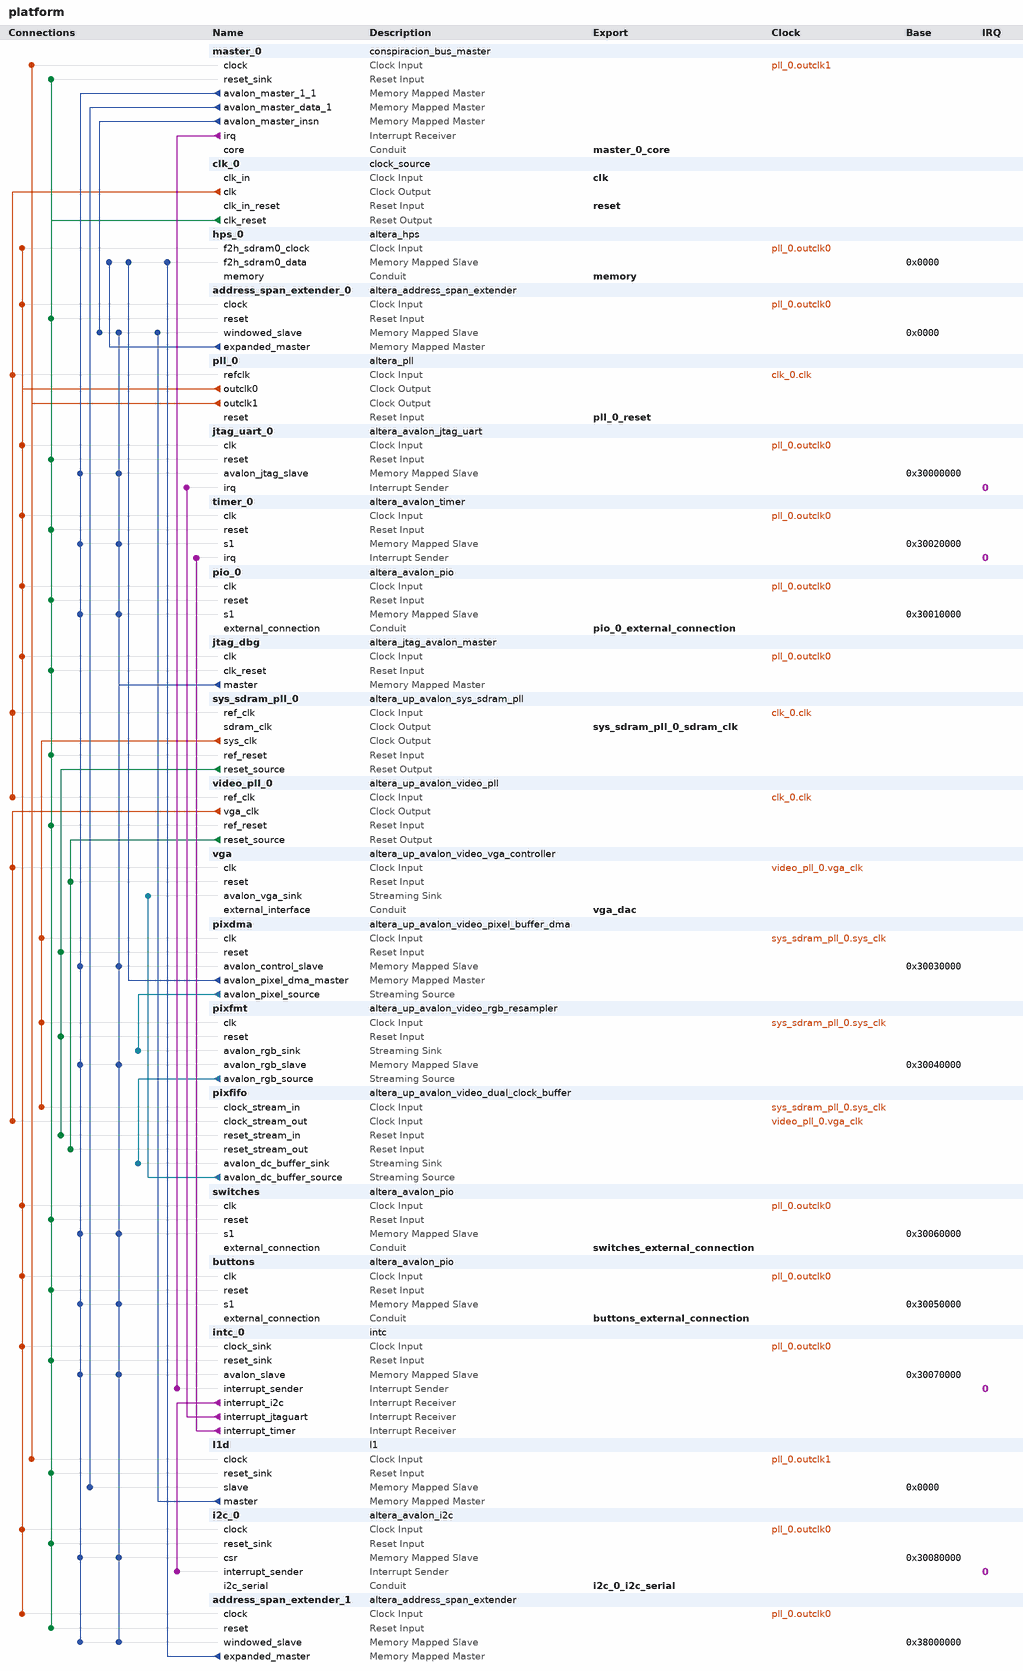
[diagram p0: system contents]
# Platform Designer (Qsys) system platform, Cyclone V 5CSEBA6U23I7
# Parameters at their usual value, and those the tool derives, are not listed.
package require -exact qsys 20.1
create_system platform
set_project_property DEVICE_FAMILY {Cyclone V}
set_project_property DEVICE 5CSEBA6U23I7

add_instance master_0 conspiracion_bus_master 1.0

add_instance clk_0 clock_source 20.1
set_instance_parameter_value clk_0 clockFrequency 50000000

add_instance hps_0 altera_hps 20.1
set_instance_parameter_value hps_0 EMAC1_Mode N/A
set_instance_parameter_value hps_0 EMAC1_PinMuxing Unused
set_instance_parameter_value hps_0 F2SCLK_COLDRST_Enable false
set_instance_parameter_value hps_0 F2SCLK_DBGRST_Enable false
set_instance_parameter_value hps_0 F2SCLK_WARMRST_Enable false
set_instance_parameter_value hps_0 F2SDRAM_Type {Avalon-MM Bidirectional}
set_instance_parameter_value hps_0 F2SDRAM_Width 128
set_instance_parameter_value hps_0 F2SINTERRUPT_Enable false
set_instance_parameter_value hps_0 F2S_Width 0
set_instance_parameter_value hps_0 FPGA_PERIPHERAL_OUTPUT_CLOCK_FREQ_EMAC0_GTX_CLK 125
set_instance_parameter_value hps_0 FPGA_PERIPHERAL_OUTPUT_CLOCK_FREQ_EMAC0_MD_CLK 2.5
set_instance_parameter_value hps_0 FPGA_PERIPHERAL_OUTPUT_CLOCK_FREQ_EMAC1_GTX_CLK 125
set_instance_parameter_value hps_0 FPGA_PERIPHERAL_OUTPUT_CLOCK_FREQ_EMAC1_MD_CLK 2.5
set_instance_parameter_value hps_0 HPS_PROTOCOL DDR3
set_instance_parameter_value hps_0 I2C0_Mode N/A
set_instance_parameter_value hps_0 I2C0_PinMuxing Unused
set_instance_parameter_value hps_0 I2C1_Mode N/A
set_instance_parameter_value hps_0 I2C1_PinMuxing Unused
set_instance_parameter_value hps_0 LWH2F_Enable false
set_instance_parameter_value hps_0 MEM_BANKADDR_WIDTH 3
set_instance_parameter_value hps_0 MEM_CLK_FREQ 300.0
set_instance_parameter_value hps_0 MEM_CLK_FREQ_MAX 400.0
set_instance_parameter_value hps_0 MEM_COL_ADDR_WIDTH 8
set_instance_parameter_value hps_0 MEM_DQ_WIDTH 8
set_instance_parameter_value hps_0 MEM_DRV_STR RZQ/6
set_instance_parameter_value hps_0 MEM_ROW_ADDR_WIDTH 12
set_instance_parameter_value hps_0 MEM_RTT_NOM {ODT Disabled}
set_instance_parameter_value hps_0 MEM_RTT_WR {Dynamic ODT off}
set_instance_parameter_value hps_0 MEM_TCL 7
set_instance_parameter_value hps_0 MEM_TFAW_NS 37.5
set_instance_parameter_value hps_0 MEM_TINIT_US 499
set_instance_parameter_value hps_0 MEM_TMRD_CK 3
set_instance_parameter_value hps_0 MEM_TRAS_NS 40.0
set_instance_parameter_value hps_0 MEM_TRCD_NS 15.0
set_instance_parameter_value hps_0 MEM_TREFI_US 7.0
set_instance_parameter_value hps_0 MEM_TRFC_NS 75.0
set_instance_parameter_value hps_0 MEM_TRP_NS 15.0
set_instance_parameter_value hps_0 MEM_TWTR 2
set_instance_parameter_value hps_0 MEM_VENDOR JEDEC
set_instance_parameter_value hps_0 MEM_WTCL 6
set_instance_parameter_value hps_0 QSPI_Mode N/A
set_instance_parameter_value hps_0 QSPI_PinMuxing Unused
set_instance_parameter_value hps_0 REF_CLK_FREQ 125.0
set_instance_parameter_value hps_0 S2FCLK_USER2CLK 5
set_instance_parameter_value hps_0 S2F_Width 0
set_instance_parameter_value hps_0 SDIO_Mode N/A
set_instance_parameter_value hps_0 SDIO_PinMuxing Unused
set_instance_parameter_value hps_0 SPIM1_Mode N/A
set_instance_parameter_value hps_0 SPIM1_PinMuxing Unused
set_instance_parameter_value hps_0 STM_Enable false
set_instance_parameter_value hps_0 TIMING_BOARD_AC_SKEW 0.02
set_instance_parameter_value hps_0 TIMING_BOARD_AC_TO_CK_SKEW 0.0
set_instance_parameter_value hps_0 TIMING_BOARD_DQ_TO_DQS_SKEW 0.0
set_instance_parameter_value hps_0 TIMING_BOARD_MAX_CK_DELAY 0.6
set_instance_parameter_value hps_0 TIMING_BOARD_MAX_DQS_DELAY 0.6
set_instance_parameter_value hps_0 TIMING_BOARD_SKEW_BETWEEN_DQS 0.02
set_instance_parameter_value hps_0 TIMING_BOARD_SKEW_CKDQS_DIMM_MAX 0.01
set_instance_parameter_value hps_0 TIMING_BOARD_SKEW_CKDQS_DIMM_MIN -0.01
set_instance_parameter_value hps_0 TIMING_BOARD_SKEW_WITHIN_DQS 0.02
set_instance_parameter_value hps_0 TIMING_TDH 125
set_instance_parameter_value hps_0 TIMING_TDQSCK 400
set_instance_parameter_value hps_0 TIMING_TDQSQ 120
set_instance_parameter_value hps_0 TIMING_TDS 50
set_instance_parameter_value hps_0 TIMING_TIH 250
set_instance_parameter_value hps_0 TIMING_TIS 175
set_instance_parameter_value hps_0 TIMING_TQSH 0.38
set_instance_parameter_value hps_0 UART0_Mode N/A
set_instance_parameter_value hps_0 UART0_PinMuxing Unused
set_instance_parameter_value hps_0 USB1_Mode N/A
set_instance_parameter_value hps_0 USB1_PinMuxing Unused
set_instance_parameter_value hps_0 desired_cfg_clk_mhz 100.0
set_instance_parameter_value hps_0 desired_qspi_clk_mhz 400.0

add_instance address_span_extender_0 altera_address_span_extender 20.1
set_instance_parameter_value address_span_extender_0 BURSTCOUNT_WIDTH 1
set_instance_parameter_value address_span_extender_0 DATA_WIDTH 128
set_instance_parameter_value address_span_extender_0 ENABLE_SLAVE_PORT false
set_instance_parameter_value address_span_extender_0 MASTER_ADDRESS_DEF 536870912
set_instance_parameter_value address_span_extender_0 MAX_PENDING_READS 1
set_instance_parameter_value address_span_extender_0 SLAVE_ADDRESS_WIDTH 25

add_instance pll_0 altera_pll 20.1
set_instance_parameter_value pll_0 gui_device_speed_grade 1
set_instance_parameter_value pll_0 gui_number_of_clocks 2
set_instance_parameter_value pll_0 gui_operation_mode direct
set_instance_parameter_value pll_0 gui_output_clock_frequency0 50.0
set_instance_parameter_value pll_0 gui_output_clock_frequency1 80.0
set_instance_parameter_value pll_0 gui_pll_auto_reset On
set_instance_parameter_value pll_0 gui_pll_mode {Fractional-N PLL}
set_instance_parameter_value pll_0 gui_reference_clock_frequency 50.0
set_instance_parameter_value pll_0 gui_use_locked false

add_instance jtag_uart_0 altera_avalon_jtag_uart 20.1
set_instance_parameter_value jtag_uart_0 simInteractiveOptions NO_INTERACTIVE_WINDOWS

add_instance timer_0 altera_avalon_timer 20.1
set_instance_parameter_value timer_0 period 1
set_instance_parameter_value timer_0 periodUnits MSEC

add_instance pio_0 altera_avalon_pio 20.1
set_instance_parameter_value pio_0 bitModifyingOutReg true
set_instance_parameter_value pio_0 direction Output
set_instance_parameter_value pio_0 width 8

add_instance jtag_dbg altera_jtag_avalon_master 20.1

add_instance sys_sdram_pll_0 altera_up_avalon_sys_sdram_pll 18.0
set_instance_parameter_value sys_sdram_pll_0 CV_boards DE1-SoC
set_instance_parameter_value sys_sdram_pll_0 gui_outclk 143.0
set_instance_parameter_value sys_sdram_pll_0 gui_refclk 50.0

add_instance video_pll_0 altera_up_avalon_video_pll 18.0
set_instance_parameter_value video_pll_0 camera {5MP Digital Camera (THDB_D5M)}
set_instance_parameter_value video_pll_0 gui_refclk 50.0
set_instance_parameter_value video_pll_0 lcd {7" LCD on VEEK-MT and MTL/MTL2 Modules}

add_instance vga altera_up_avalon_video_vga_controller 18.0
set_instance_parameter_value vga board DE1-SoC
set_instance_parameter_value vga resolution {VGA 640x480}

add_instance pixdma altera_up_avalon_video_pixel_buffer_dma 18.0
set_instance_parameter_value pixdma addr_mode Consecutive
set_instance_parameter_value pixdma back_start_address 947912704
set_instance_parameter_value pixdma color_space {32-bit RGBA}
set_instance_parameter_value pixdma image_height 480
set_instance_parameter_value pixdma image_width 640
set_instance_parameter_value pixdma start_address 939524096

add_instance pixfmt altera_up_avalon_video_rgb_resampler 18.0
set_instance_parameter_value pixfmt alpha 1023
set_instance_parameter_value pixfmt input_type {32-bit RGBA}
set_instance_parameter_value pixfmt output_type {30-bit RGB}

add_instance pixfifo altera_up_avalon_video_dual_clock_buffer 18.0
set_instance_parameter_value pixfifo color_bits 10

add_instance switches altera_avalon_pio 20.1
set_instance_parameter_value switches direction Input
set_instance_parameter_value switches width 8

add_instance buttons altera_avalon_pio 20.1
set_instance_parameter_value buttons direction Input
set_instance_parameter_value buttons width 8

add_instance intc_0 intc 1.0

add_instance l1d l1 1.0
set_instance_parameter_value l1d cache_entry 10

add_instance i2c_0 altera_avalon_i2c 20.1
set_instance_parameter_value i2c_0 FIFO_DEPTH 4

add_instance address_span_extender_1 altera_address_span_extender 20.1
set_instance_parameter_value address_span_extender_1 BURSTCOUNT_WIDTH 1
set_instance_parameter_value address_span_extender_1 DATA_WIDTH 32
set_instance_parameter_value address_span_extender_1 ENABLE_SLAVE_PORT false
set_instance_parameter_value address_span_extender_1 MASTER_ADDRESS_DEF 939524096
set_instance_parameter_value address_span_extender_1 MAX_PENDING_READS 1
set_instance_parameter_value address_span_extender_1 SLAVE_ADDRESS_WIDTH 22

# connections
add_connection clk_0.clk pll_0.refclk clock
add_connection clk_0.clk sys_sdram_pll_0.ref_clk clock
add_connection clk_0.clk video_pll_0.ref_clk clock
add_connection pll_0.outclk0 address_span_extender_0.clock clock
add_connection pll_0.outclk0 address_span_extender_1.clock clock
add_connection pll_0.outclk0 buttons.clk clock
add_connection pll_0.outclk0 hps_0.f2h_sdram0_clock clock
add_connection pll_0.outclk0 i2c_0.clock clock
add_connection pll_0.outclk0 intc_0.clock_sink clock
add_connection pll_0.outclk0 jtag_dbg.clk clock
add_connection pll_0.outclk0 jtag_uart_0.clk clock
add_connection pll_0.outclk0 pio_0.clk clock
add_connection pll_0.outclk0 switches.clk clock
add_connection pll_0.outclk0 timer_0.clk clock
add_connection pll_0.outclk1 l1d.clock clock
add_connection pll_0.outclk1 master_0.clock clock
add_connection sys_sdram_pll_0.sys_clk pixdma.clk clock
add_connection sys_sdram_pll_0.sys_clk pixfifo.clock_stream_in clock
add_connection sys_sdram_pll_0.sys_clk pixfmt.clk clock
add_connection video_pll_0.vga_clk pixfifo.clock_stream_out clock
add_connection video_pll_0.vga_clk vga.clk clock
add_connection clk_0.clk_reset address_span_extender_0.reset reset
add_connection clk_0.clk_reset address_span_extender_1.reset reset
add_connection clk_0.clk_reset buttons.reset reset
add_connection clk_0.clk_reset i2c_0.reset_sink reset
add_connection clk_0.clk_reset intc_0.reset_sink reset
add_connection clk_0.clk_reset jtag_dbg.clk_reset reset
add_connection clk_0.clk_reset jtag_uart_0.reset reset
add_connection clk_0.clk_reset l1d.reset_sink reset
add_connection clk_0.clk_reset master_0.reset_sink reset
add_connection clk_0.clk_reset pio_0.reset reset
add_connection clk_0.clk_reset switches.reset reset
add_connection clk_0.clk_reset sys_sdram_pll_0.ref_reset reset
add_connection clk_0.clk_reset timer_0.reset reset
add_connection clk_0.clk_reset video_pll_0.ref_reset reset
add_connection sys_sdram_pll_0.reset_source pixdma.reset reset
add_connection sys_sdram_pll_0.reset_source pixfifo.reset_stream_in reset
add_connection sys_sdram_pll_0.reset_source pixfmt.reset reset
add_connection video_pll_0.reset_source pixfifo.reset_stream_out reset
add_connection video_pll_0.reset_source vga.reset reset
add_connection address_span_extender_0.expanded_master hps_0.f2h_sdram0_data avalon
set_connection_parameter_value address_span_extender_0.expanded_master/hps_0.f2h_sdram0_data baseAddress 0x0000
add_connection address_span_extender_1.expanded_master hps_0.f2h_sdram0_data avalon
set_connection_parameter_value address_span_extender_1.expanded_master/hps_0.f2h_sdram0_data baseAddress 0x0000
add_connection jtag_dbg.master address_span_extender_0.windowed_slave avalon
set_connection_parameter_value jtag_dbg.master/address_span_extender_0.windowed_slave baseAddress 0x0000
add_connection jtag_dbg.master address_span_extender_1.windowed_slave avalon
set_connection_parameter_value jtag_dbg.master/address_span_extender_1.windowed_slave baseAddress 0x38000000
add_connection jtag_dbg.master buttons.s1 avalon
set_connection_parameter_value jtag_dbg.master/buttons.s1 baseAddress 0x30050000
add_connection jtag_dbg.master i2c_0.csr avalon
set_connection_parameter_value jtag_dbg.master/i2c_0.csr baseAddress 0x30080000
add_connection jtag_dbg.master intc_0.avalon_slave avalon
set_connection_parameter_value jtag_dbg.master/intc_0.avalon_slave baseAddress 0x30070000
add_connection jtag_dbg.master jtag_uart_0.avalon_jtag_slave avalon
set_connection_parameter_value jtag_dbg.master/jtag_uart_0.avalon_jtag_slave baseAddress 0x30000000
add_connection jtag_dbg.master pio_0.s1 avalon
set_connection_parameter_value jtag_dbg.master/pio_0.s1 baseAddress 0x30010000
add_connection jtag_dbg.master pixdma.avalon_control_slave avalon
set_connection_parameter_value jtag_dbg.master/pixdma.avalon_control_slave baseAddress 0x30030000
add_connection jtag_dbg.master pixfmt.avalon_rgb_slave avalon
set_connection_parameter_value jtag_dbg.master/pixfmt.avalon_rgb_slave baseAddress 0x30040000
add_connection jtag_dbg.master switches.s1 avalon
set_connection_parameter_value jtag_dbg.master/switches.s1 baseAddress 0x30060000
add_connection jtag_dbg.master timer_0.s1 avalon
set_connection_parameter_value jtag_dbg.master/timer_0.s1 baseAddress 0x30020000
add_connection l1d.master address_span_extender_0.windowed_slave avalon
set_connection_parameter_value l1d.master/address_span_extender_0.windowed_slave baseAddress 0x0000
add_connection master_0.avalon_master_1_1 address_span_extender_1.windowed_slave avalon
set_connection_parameter_value master_0.avalon_master_1_1/address_span_extender_1.windowed_slave baseAddress 0x38000000
add_connection master_0.avalon_master_1_1 buttons.s1 avalon
set_connection_parameter_value master_0.avalon_master_1_1/buttons.s1 baseAddress 0x30050000
add_connection master_0.avalon_master_1_1 i2c_0.csr avalon
set_connection_parameter_value master_0.avalon_master_1_1/i2c_0.csr baseAddress 0x30080000
add_connection master_0.avalon_master_1_1 intc_0.avalon_slave avalon
set_connection_parameter_value master_0.avalon_master_1_1/intc_0.avalon_slave baseAddress 0x30070000
add_connection master_0.avalon_master_1_1 jtag_uart_0.avalon_jtag_slave avalon
set_connection_parameter_value master_0.avalon_master_1_1/jtag_uart_0.avalon_jtag_slave baseAddress 0x30000000
add_connection master_0.avalon_master_1_1 pio_0.s1 avalon
set_connection_parameter_value master_0.avalon_master_1_1/pio_0.s1 baseAddress 0x30010000
add_connection master_0.avalon_master_1_1 pixdma.avalon_control_slave avalon
set_connection_parameter_value master_0.avalon_master_1_1/pixdma.avalon_control_slave baseAddress 0x30030000
add_connection master_0.avalon_master_1_1 pixfmt.avalon_rgb_slave avalon
set_connection_parameter_value master_0.avalon_master_1_1/pixfmt.avalon_rgb_slave baseAddress 0x30040000
add_connection master_0.avalon_master_1_1 switches.s1 avalon
set_connection_parameter_value master_0.avalon_master_1_1/switches.s1 baseAddress 0x30060000
add_connection master_0.avalon_master_1_1 timer_0.s1 avalon
set_connection_parameter_value master_0.avalon_master_1_1/timer_0.s1 baseAddress 0x30020000
add_connection master_0.avalon_master_data_1 l1d.slave avalon
set_connection_parameter_value master_0.avalon_master_data_1/l1d.slave baseAddress 0x0000
add_connection master_0.avalon_master_insn address_span_extender_0.windowed_slave avalon
set_connection_parameter_value master_0.avalon_master_insn/address_span_extender_0.windowed_slave baseAddress 0x0000
add_connection pixdma.avalon_pixel_dma_master hps_0.f2h_sdram0_data avalon
set_connection_parameter_value pixdma.avalon_pixel_dma_master/hps_0.f2h_sdram0_data baseAddress 0x0000
add_connection pixdma.avalon_pixel_source pixfmt.avalon_rgb_sink avalon_streaming
add_connection pixfifo.avalon_dc_buffer_source vga.avalon_vga_sink avalon_streaming
add_connection pixfmt.avalon_rgb_source pixfifo.avalon_dc_buffer_sink avalon_streaming
add_connection intc_0.interrupt_i2c i2c_0.interrupt_sender interrupt
set_connection_parameter_value intc_0.interrupt_i2c/i2c_0.interrupt_sender irqNumber 0
add_connection intc_0.interrupt_jtaguart jtag_uart_0.irq interrupt
set_connection_parameter_value intc_0.interrupt_jtaguart/jtag_uart_0.irq irqNumber 0
add_connection intc_0.interrupt_timer timer_0.irq interrupt
set_connection_parameter_value intc_0.interrupt_timer/timer_0.irq irqNumber 0
add_connection master_0.irq intc_0.interrupt_sender interrupt
set_connection_parameter_value master_0.irq/intc_0.interrupt_sender irqNumber 0

# exported interfaces
add_interface buttons_external_connection conduit end
set_interface_property buttons_external_connection EXPORT_OF buttons.external_connection
add_interface clk clock sink
set_interface_property clk EXPORT_OF clk_0.clk_in
add_interface i2c_0_i2c_serial conduit end
set_interface_property i2c_0_i2c_serial EXPORT_OF i2c_0.i2c_serial
add_interface master_0_core conduit end
set_interface_property master_0_core EXPORT_OF master_0.core
add_interface memory conduit end
set_interface_property memory EXPORT_OF hps_0.memory
add_interface pio_0_external_connection conduit end
set_interface_property pio_0_external_connection EXPORT_OF pio_0.external_connection
add_interface pll_0_reset reset sink
set_interface_property pll_0_reset EXPORT_OF pll_0.reset
add_interface reset reset sink
set_interface_property reset EXPORT_OF clk_0.clk_in_reset
add_interface switches_external_connection conduit end
set_interface_property switches_external_connection EXPORT_OF switches.external_connection
add_interface sys_sdram_pll_0_sdram_clk clock source
set_interface_property sys_sdram_pll_0_sdram_clk EXPORT_OF sys_sdram_pll_0.sdram_clk
add_interface vga_dac conduit end
set_interface_property vga_dac EXPORT_OF vga.external_interface

set_interconnect_requirement {$system} qsys_mm.clockCrossingAdapter HANDSHAKE
set_interconnect_requirement {$system} qsys_mm.enableEccProtection FALSE
set_interconnect_requirement {$system} qsys_mm.enableInstrumentation FALSE
set_interconnect_requirement {$system} qsys_mm.insertDefaultSlave FALSE
set_interconnect_requirement {$system} qsys_mm.maxAdditionalLatency 1

save_system platform.qsys
